# Altium schematic sheet RP5_Main_Board.SchDoc
size 400 x 299 mm; SheetNumber: 1; SheetTotal: 7
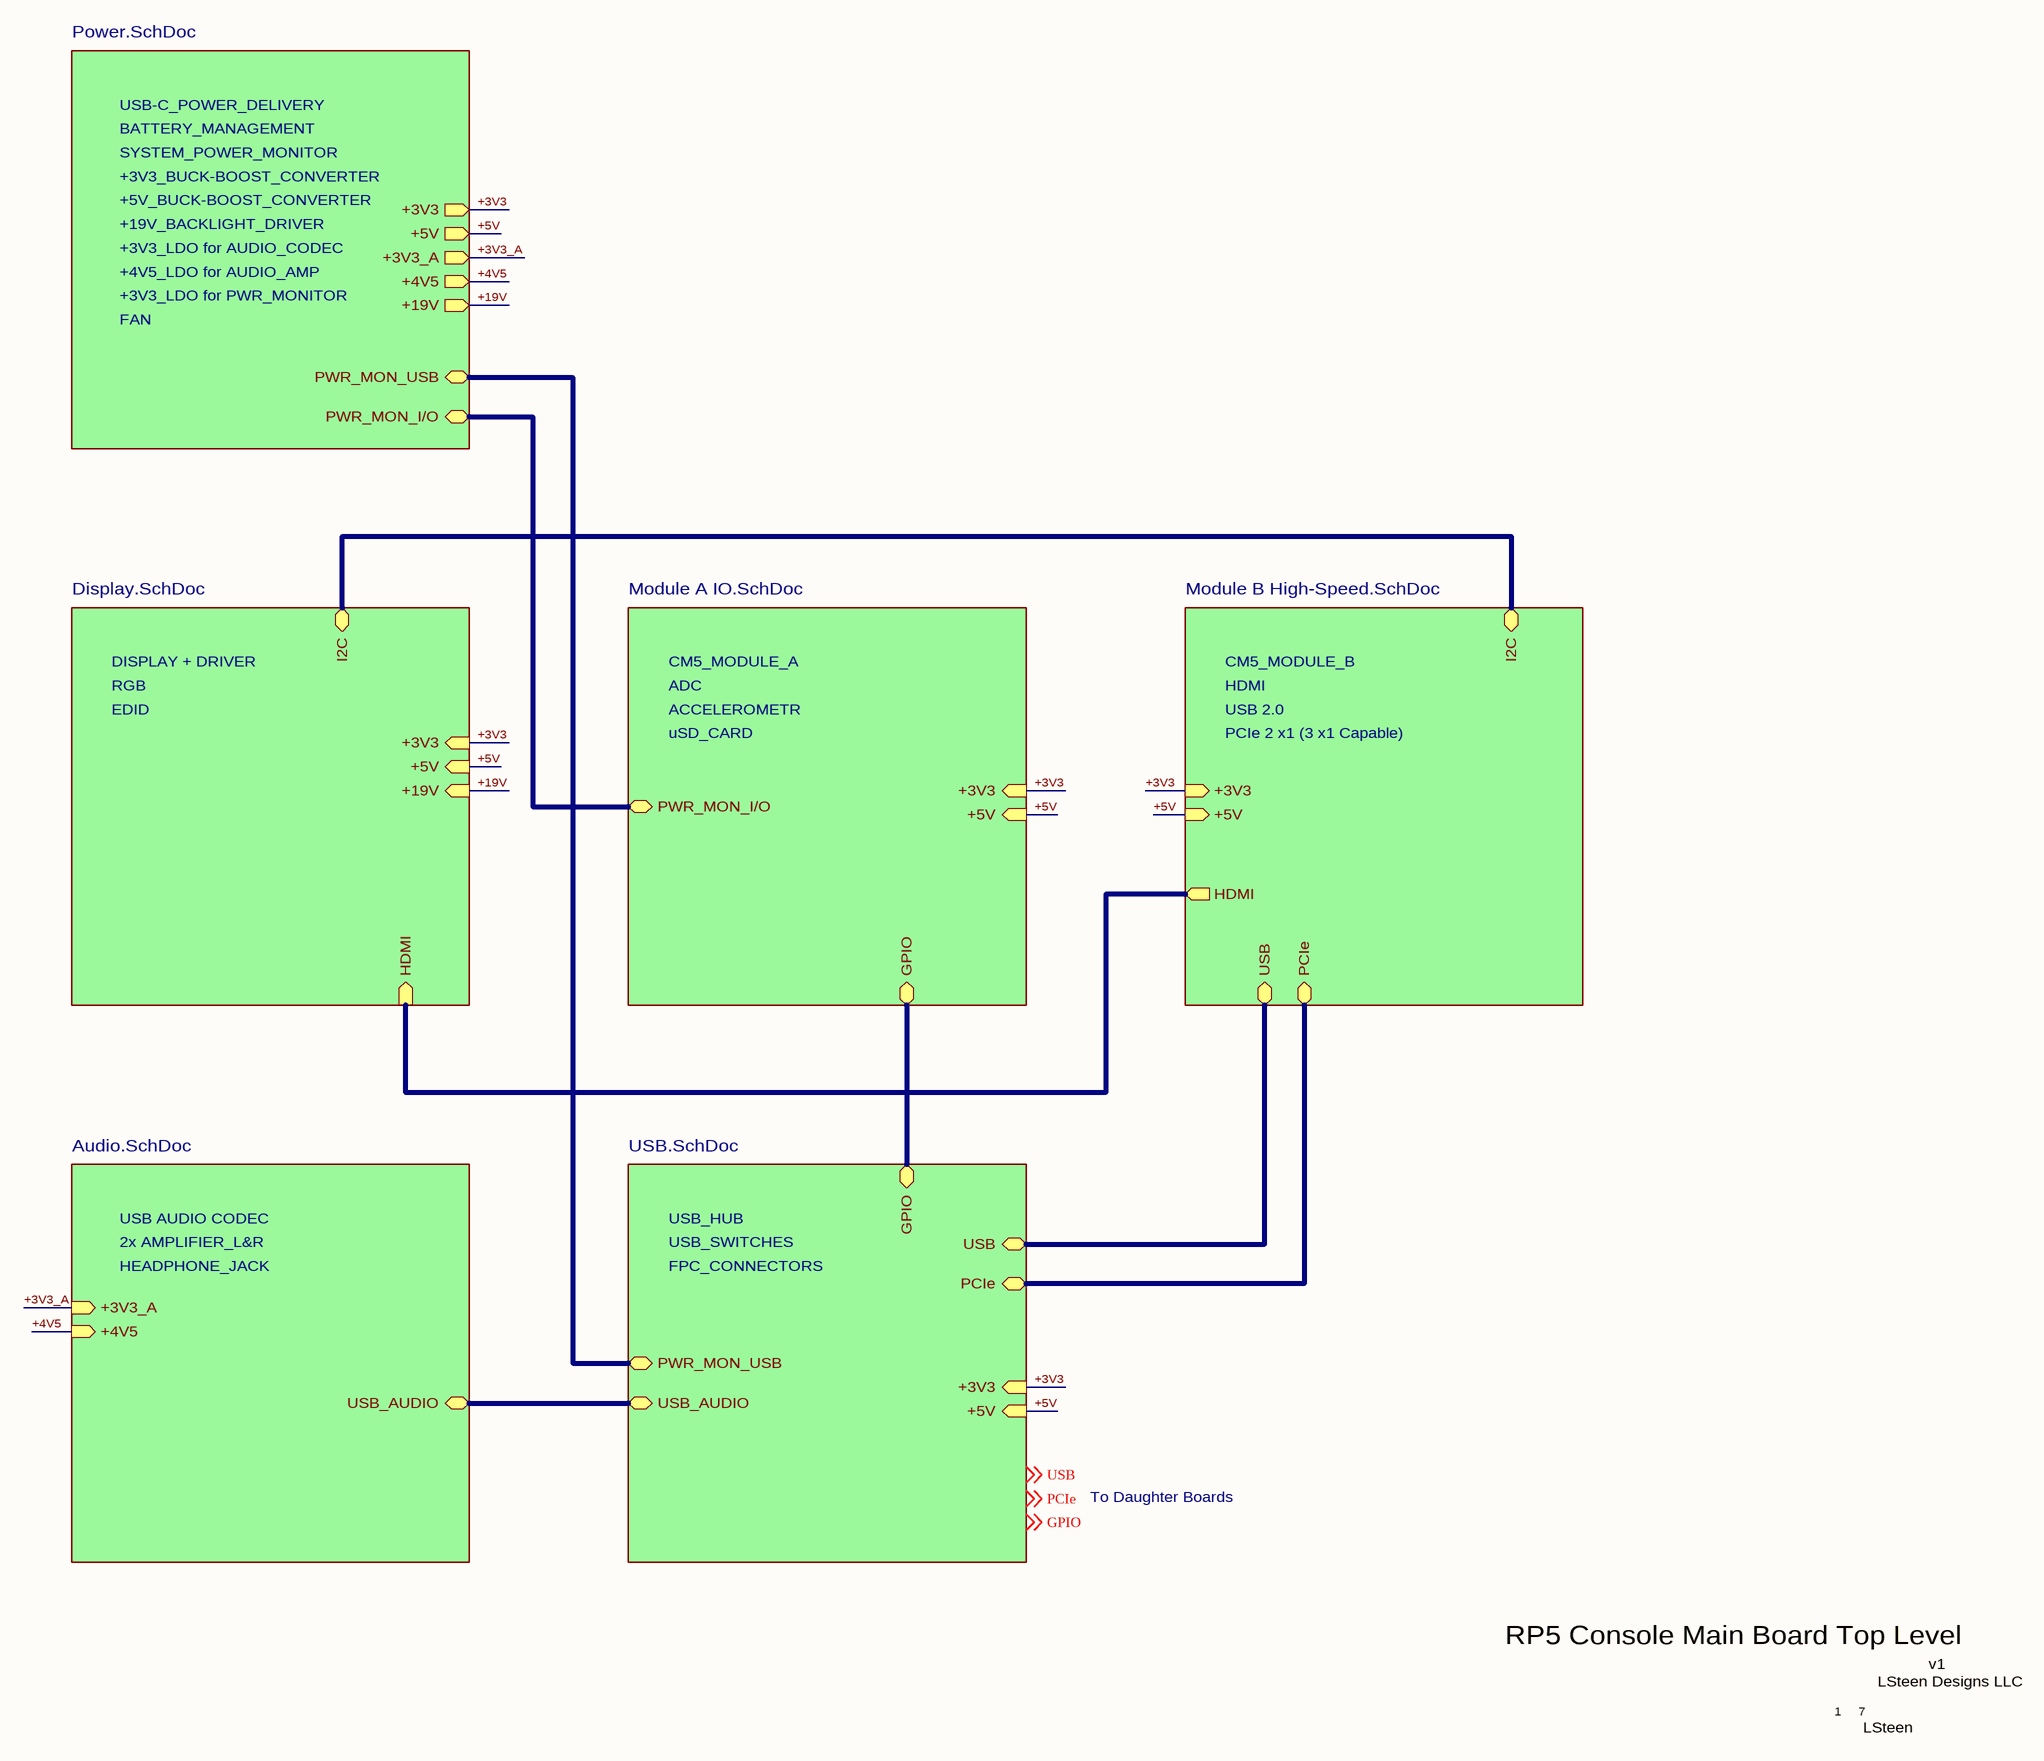
[diagram p0: RP5_Main_Board.SchDoc]

## Sub-sheets
Audio = Audio.SchDoc: USB_AUDIO (bidir), +3V3_A (in), +4V5 (in)
Display = Display.SchDoc: HDMI (in), +3V3 (in), +5V (in), +19V (in), I2C (bidir)
Module A IO = Module A IO.SchDoc: GPIO (bidir), +3V3 (in), +5V (in), PWR_MON_I/O (bidir)
Module B High-Speed = Module B High-Speed.SchDoc: PCIe (bidir), USB (bidir), HDMI (out), +3V3 (in), +5V (in), I2C (bidir)
Power = Power.SchDoc: PWR_MON_I/O (bidir), +3V3_A (out), +5V (out), +3V3 (out), +19V (out), +4V5 (out), PWR_MON_USB (bidir)
USB = USB.SchDoc: PCIe (bidir), USB (bidir), GPIO (bidir), USB_AUDIO (bidir), +3V3 (in), +5V (in), PWR_MON_USB (bidir)

## Nets
+3V3: sheet Power/+3V3, sheet Display/+3V3, sheet Module A IO/+3V3, sheet Module B High-Speed/+3V3, sheet USB/+3V3
+3V3_A: sheet Power/+3V3_A, sheet Audio/+3V3_A
+4V5: sheet Power/+4V5, sheet Audio/+4V5
+5V: sheet Power/+5V, sheet Display/+5V, sheet Module A IO/+5V, sheet Module B High-Speed/+5V, sheet USB/+5V
+19V: sheet Power/+19V, sheet Display/+19V
(unnamed): sheet Power/PWR_MON_I/O, sheet Module A IO/PWR_MON_I/O
(unnamed): sheet Power/PWR_MON_USB, sheet USB/PWR_MON_USB
(unnamed): sheet Display/HDMI, sheet Module B High-Speed/HDMI
(unnamed): sheet Display/I2C, sheet Module B High-Speed/I2C
(unnamed): sheet Module A IO/GPIO, sheet USB/GPIO
(unnamed): sheet Module B High-Speed/PCIe, sheet USB/PCIe
(unnamed): sheet Module B High-Speed/USB, sheet USB/USB
(unnamed): sheet Audio/USB_AUDIO, sheet USB/USB_AUDIO

## Notes on the sheet
- USB-C_POWER_DELIVERY
- BATTERY_MANAGEMENT
- +3V3_BUCK-BOOST_CONVERTER
- +5V_BUCK-BOOST_CONVERTER
- SYSTEM_POWER_MONITOR
- +19V_BACKLIGHT_DRIVER
- +3V3_LDO for AUDIO_CODEC
- +4V5_LDO for AUDIO_AMP
- +3V3_LDO for PWR_MONITOR
- FAN
- DISPLAY + DRIVER
- RGB
- ADC
- CM5_MODULE_A
- CM5_MODULE_B
- HDMI
- EDID
- ACCELEROMETR
- uSD_CARD
- USB 2.0
- PCIe 2 x1 (3 x1 Capable)
- USB AUDIO CODEC
- USB_HUB
- HEADPHONE_JACK
- 2x AMPLIFIER_L&R
- USB_SWITCHES
- FPC_CONNECTORS
- To Daughter Boards
- RP5 Console Main Board Top Level
- 1
- 7
- LSteen Designs LLC
- v1
- LSteen
- Labels drawn without touching a wire or pin: GPIO, PCIe, USB